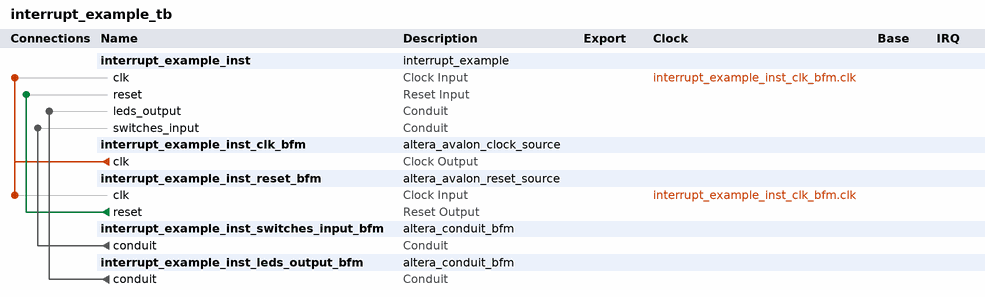
[diagram p0: system contents]
# Platform Designer (Qsys) system interrupt_example_tb, Cyclone IV GX Unknown
# Parameters at their usual value, and those the tool derives, are not listed.
package require -exact qsys 13.1
create_system interrupt_example_tb
set_project_property DEVICE_FAMILY {Cyclone IV GX}
set_project_property DEVICE Unknown

add_instance interrupt_example_inst interrupt_example 1.0

add_instance interrupt_example_inst_clk_bfm altera_avalon_clock_source 13.1

add_instance interrupt_example_inst_reset_bfm altera_avalon_reset_source 13.1
set_instance_parameter_value interrupt_example_inst_reset_bfm ASSERT_HIGH_RESET 0
set_instance_parameter_value interrupt_example_inst_reset_bfm INITIAL_RESET_CYCLES 50

add_instance interrupt_example_inst_switches_input_bfm altera_conduit_bfm 13.1
set_instance_parameter_value interrupt_example_inst_switches_input_bfm CLOCKED_SIGNAL false
set_instance_parameter_value interrupt_example_inst_switches_input_bfm ENABLE_RESET false
set_instance_parameter_value interrupt_example_inst_switches_input_bfm SIGNAL_WIDTHS 8
set_instance_parameter_value interrupt_example_inst_switches_input_bfm SIGNAL_DIRECTIONS output

add_instance interrupt_example_inst_leds_output_bfm altera_conduit_bfm 13.1
set_instance_parameter_value interrupt_example_inst_leds_output_bfm CLOCKED_SIGNAL false
set_instance_parameter_value interrupt_example_inst_leds_output_bfm ENABLE_RESET false
set_instance_parameter_value interrupt_example_inst_leds_output_bfm SIGNAL_WIDTHS 8
set_instance_parameter_value interrupt_example_inst_leds_output_bfm SIGNAL_DIRECTIONS input

# connections
add_connection interrupt_example_inst_clk_bfm.clk interrupt_example_inst.clk clock
add_connection interrupt_example_inst_clk_bfm.clk interrupt_example_inst_reset_bfm.clk clock
add_connection interrupt_example_inst_reset_bfm.reset interrupt_example_inst.reset reset
add_connection interrupt_example_inst_leds_output_bfm.conduit interrupt_example_inst.leds_output conduit
add_connection interrupt_example_inst_switches_input_bfm.conduit interrupt_example_inst.switches_input conduit

set_interconnect_requirement {$system} qsys_mm.clockCrossingAdapter HANDSHAKE
set_interconnect_requirement {$system} qsys_mm.maxAdditionalLatency 1
set_interconnect_requirement {$system} qsys_mm.insertDefaultSlave false

save_system interrupt_example_tb.qsys
